# Altium project Power management module.PrjPcb
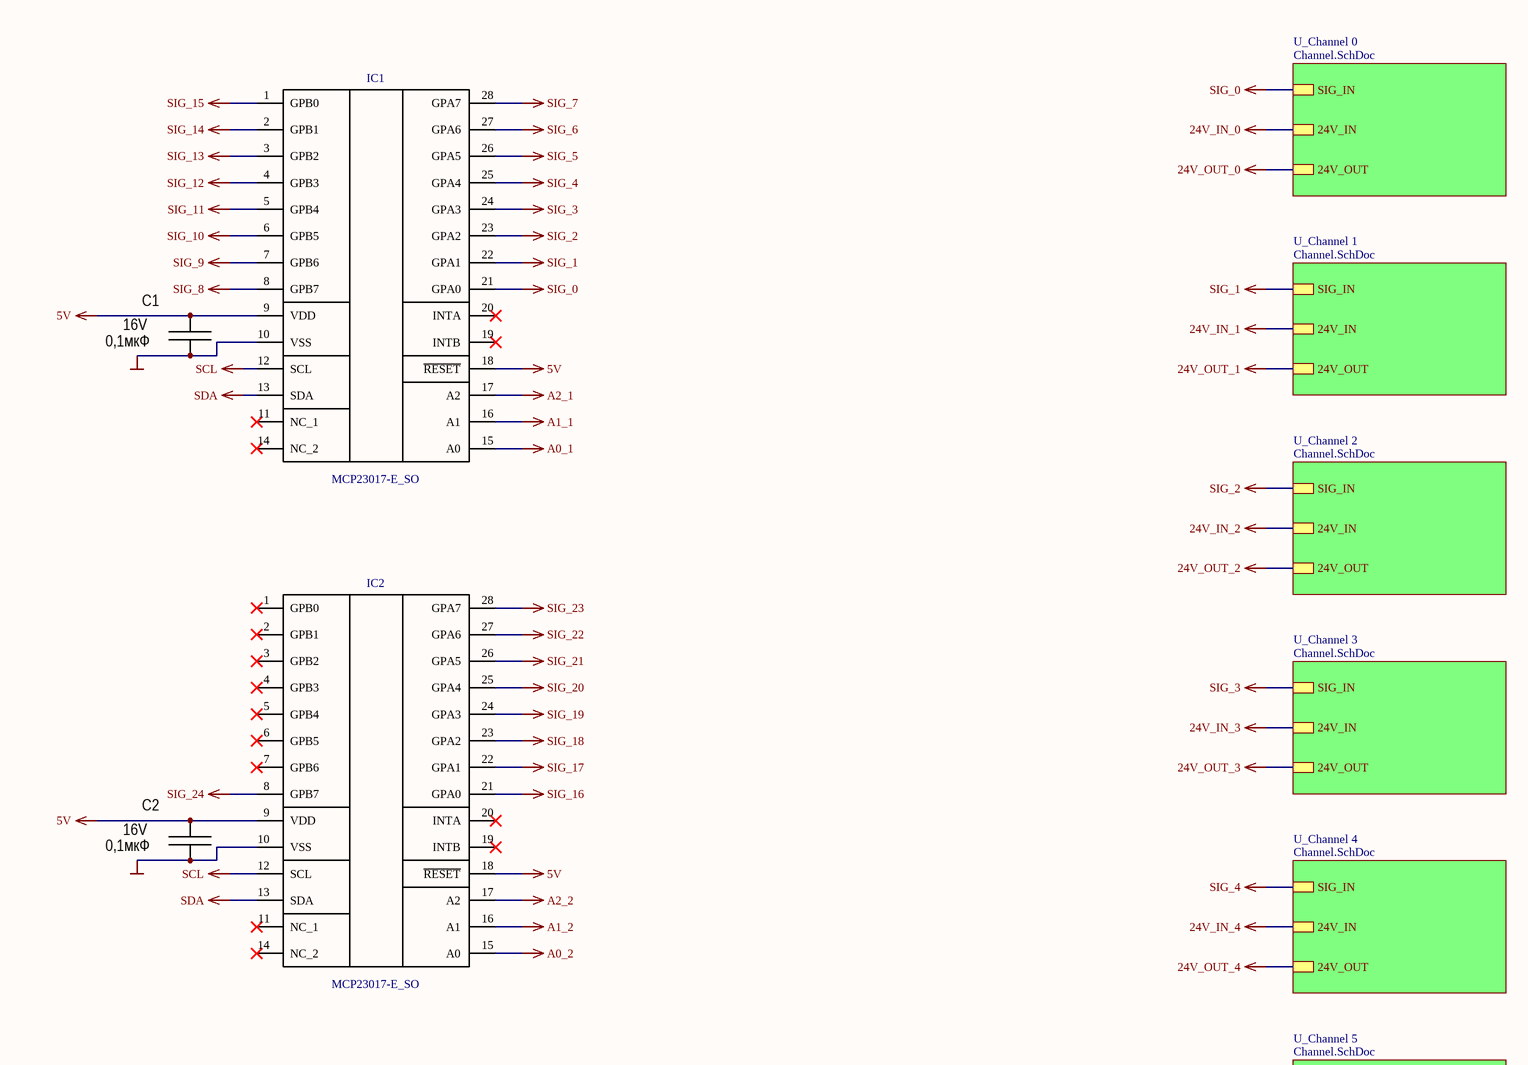
[diagram p0: Scheme.SchDoc, top left]
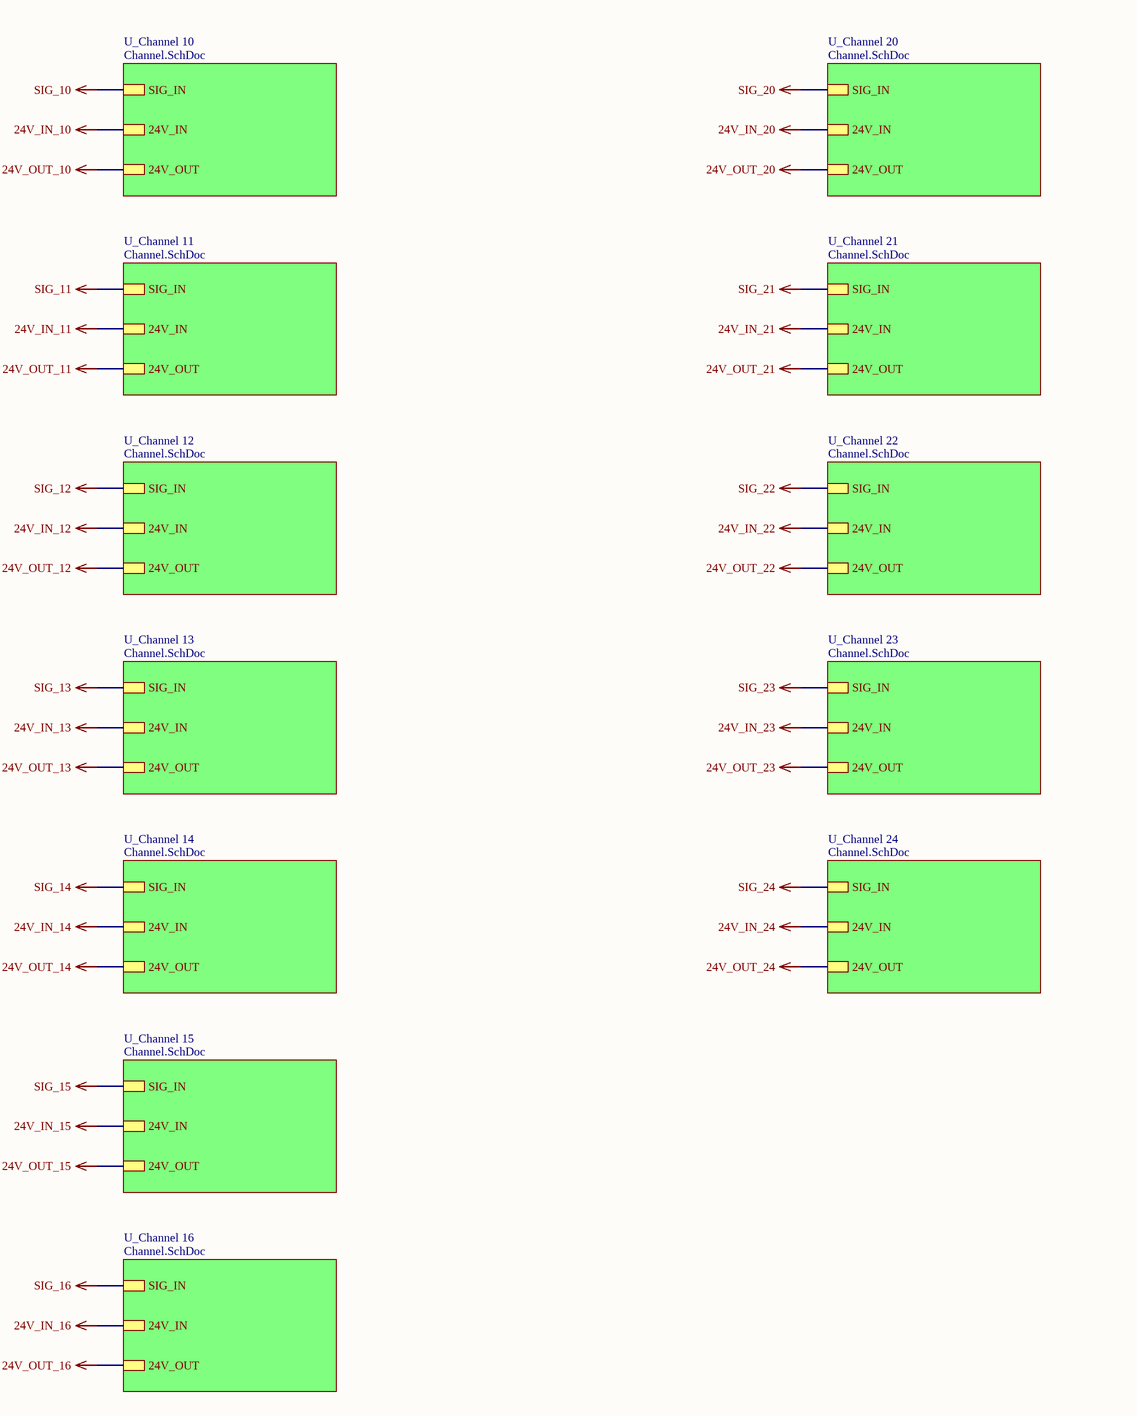
[diagram p1: Scheme.SchDoc, top right]
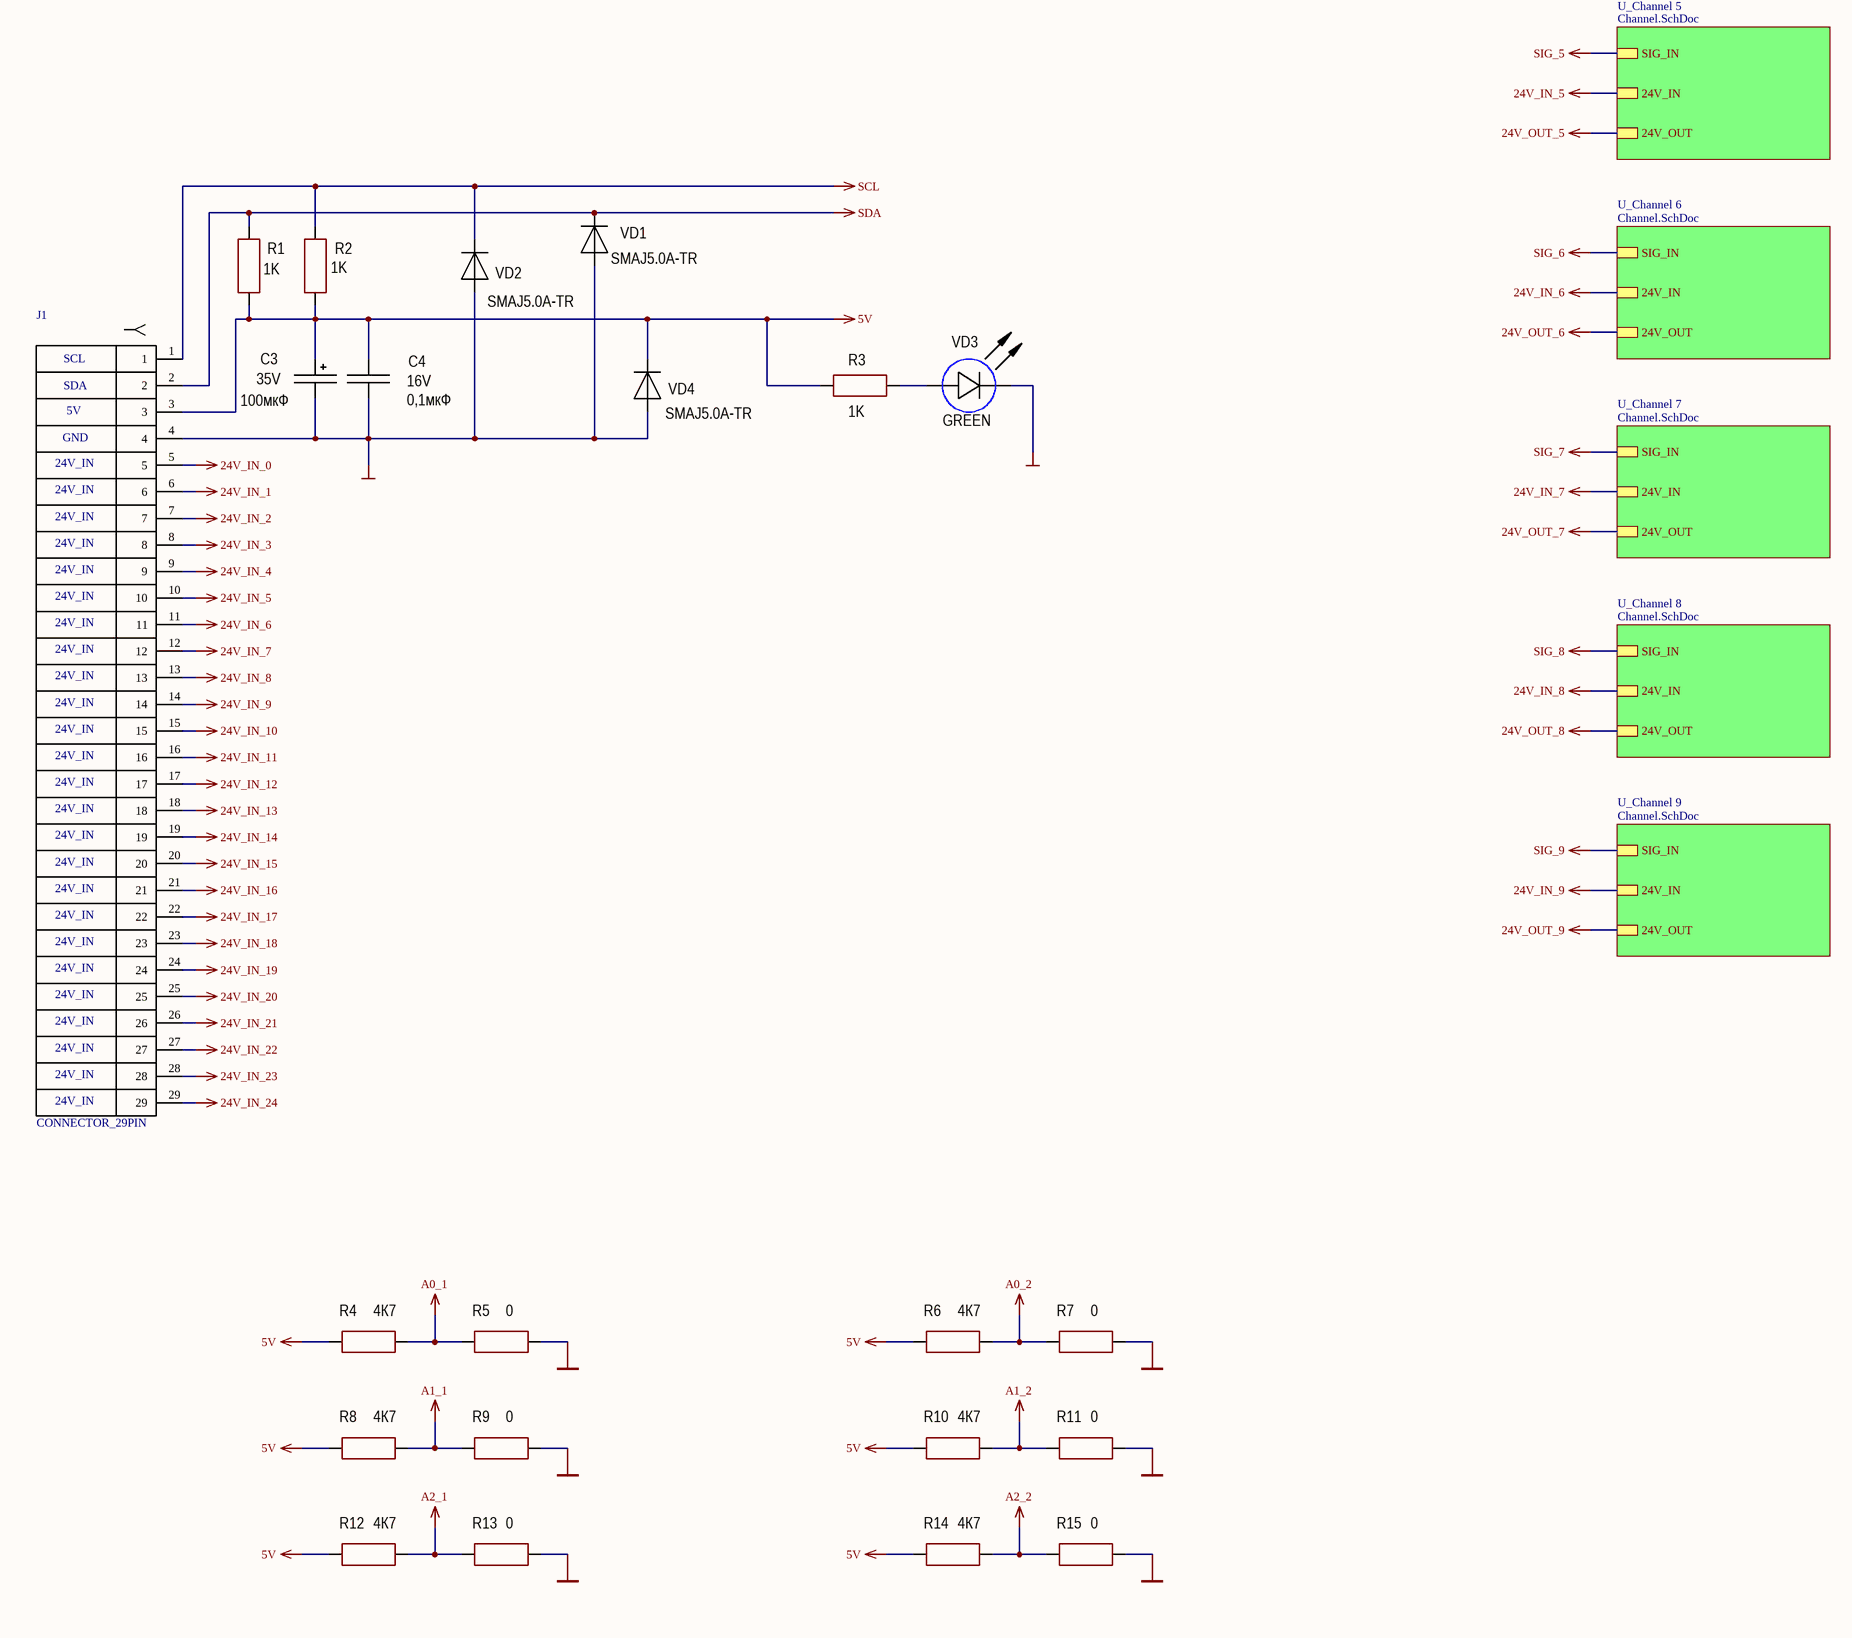
[diagram p2: Scheme.SchDoc, bottom left]
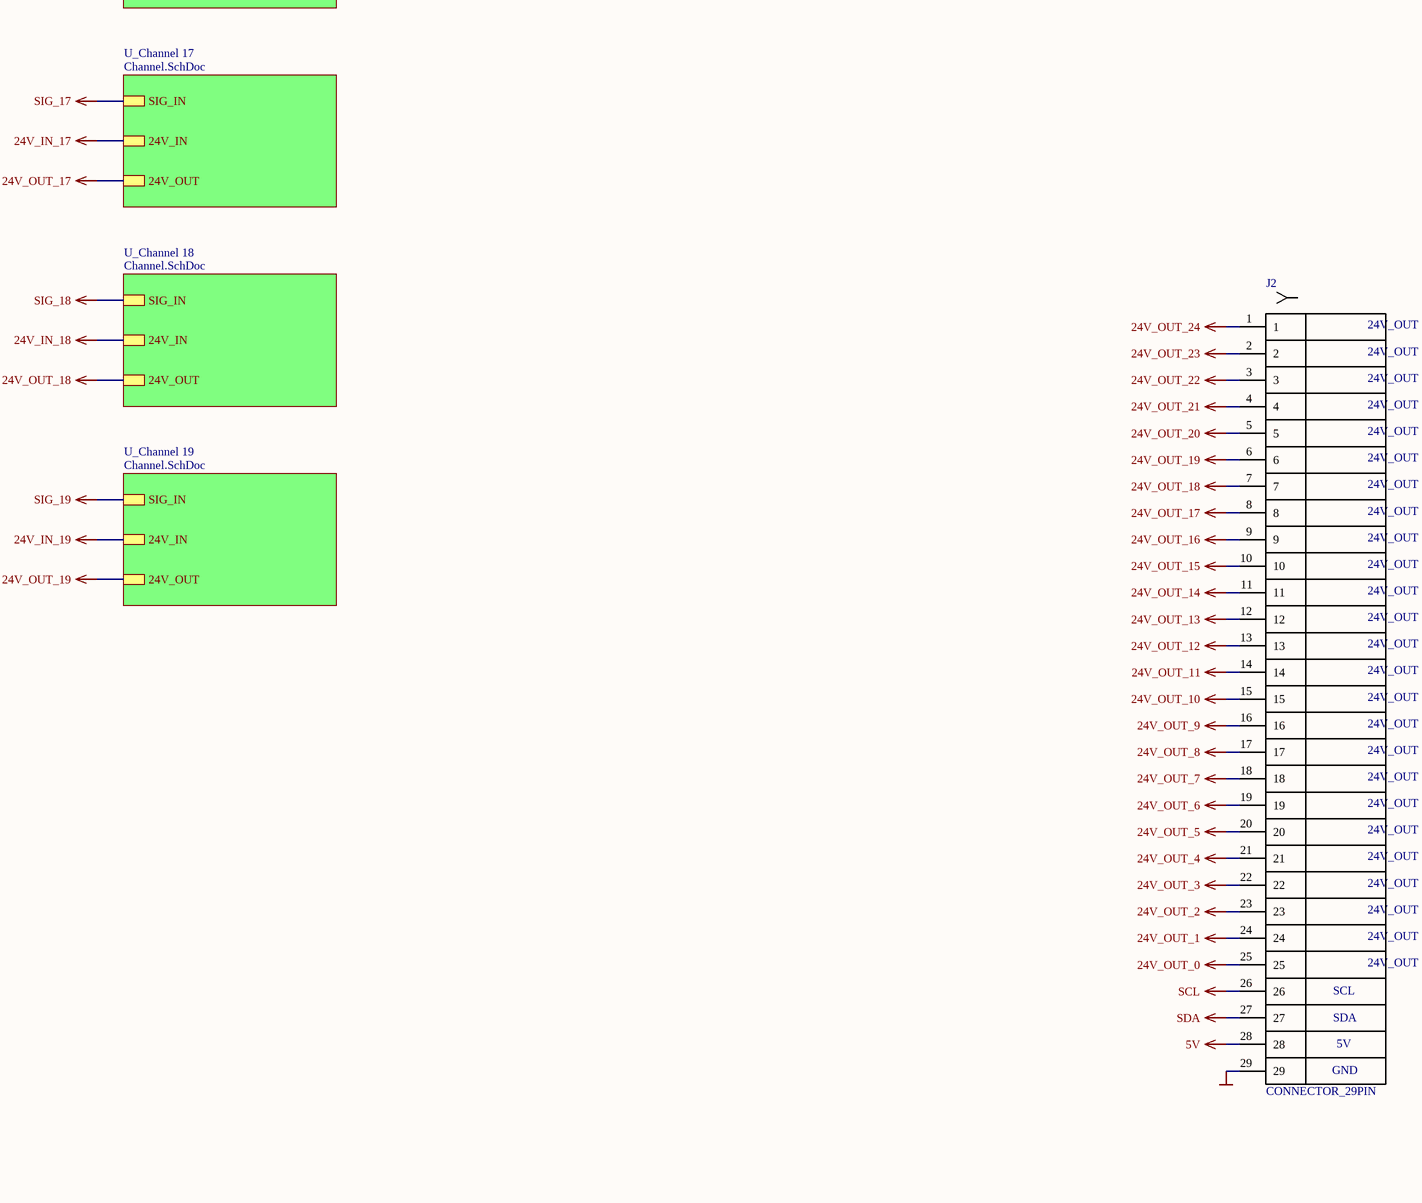
[diagram p3: Scheme.SchDoc, bottom right]
2 sheets, 227 parts. Net scope: hierarchical (ports join the sheet entries above them; power ports are global).
Board files: PCB.PcbDoc, PCB_v2.PcbDoc
Sheets:
  Scheme.SchDoc
    U_Channel 0 = Channel.SchDoc
    U_Channel 1 = Channel.SchDoc
    U_Channel 2 = Channel.SchDoc
    U_Channel 3 = Channel.SchDoc
    U_Channel 4 = Channel.SchDoc
    U_Channel 5 = Channel.SchDoc
    U_Channel 6 = Channel.SchDoc
    U_Channel 7 = Channel.SchDoc
    U_Channel 8 = Channel.SchDoc
    U_Channel 9 = Channel.SchDoc
    U_Channel 10 = Channel.SchDoc
    U_Channel 11 = Channel.SchDoc
    U_Channel 12 = Channel.SchDoc
    U_Channel 13 = Channel.SchDoc
    U_Channel 14 = Channel.SchDoc
    U_Channel 15 = Channel.SchDoc
    U_Channel 16 = Channel.SchDoc
    U_Channel 17 = Channel.SchDoc
    U_Channel 18 = Channel.SchDoc
    U_Channel 19 = Channel.SchDoc
    U_Channel 20 = Channel.SchDoc
    U_Channel 21 = Channel.SchDoc
    U_Channel 22 = Channel.SchDoc
    U_Channel 23 = Channel.SchDoc
    U_Channel 24 = Channel.SchDoc

## Sheet Scheme.SchDoc
size A1

### Parts
C1  value 0,1мкФ  Voltage: 16V  [CAP: 0805]
C2  value 0,1мкФ  Voltage: 16V  [CAP: 0805]
C3  value 100мкФ  Voltage: 35V  [CAP: D8C3.5H12]
C4  value 0,1мкФ  Voltage: 16V  [CAP: 0805]
IC1  MCP23017-E_SO  [SOIC127P1030X265-28N]
IC2  MCP23017-E_SO  [SOIC127P1030X265-28N]
J1  CONNECTOR_29PIN  [Connector_29pin]
J2  CONNECTOR_29PIN  [Connector_29pin]
R1  value 1K  [RES: 0805]
R2  value 1K  [RES: 0805]
R3  value 1K  [RES: 0805]
R4  value 4К7  [RES: 0805]
R5  value 0  [RES: 0805]
R6  value 4К7  [RES: 0805]
R7  value 0  [RES: 0805]
R8  value 4К7  [RES: 0805]
R9  value 0  [RES: 0805]
R10  value 4К7  [RES: 0805]
R11  value 0  [RES: 0805]
R12  value 4К7  [RES: 0805]
R13  value 0  [RES: 0805]
R14  value 4К7  [RES: 0805]
R15  value 0  [RES: 0805]
VD1  PartNumber: SMAJ5.0A-TR  [DIODE: SMA]
VD2  PartNumber: SMAJ5.0A-TR  [DIODE: SMA]
VD3  Color: GREEN  [1224HRC5]
VD4  PartNumber: SMAJ5.0A-TR  [DIODE: SMA]

### Sub-sheets
U_Channel 0 = Channel.SchDoc: SIG_IN, 24V_IN, 24V_OUT
U_Channel 1 = Channel.SchDoc: SIG_IN, 24V_IN, 24V_OUT
U_Channel 2 = Channel.SchDoc: SIG_IN, 24V_IN, 24V_OUT
U_Channel 3 = Channel.SchDoc: SIG_IN, 24V_IN, 24V_OUT
U_Channel 4 = Channel.SchDoc: SIG_IN, 24V_IN, 24V_OUT
U_Channel 5 = Channel.SchDoc: SIG_IN, 24V_IN, 24V_OUT
U_Channel 6 = Channel.SchDoc: SIG_IN, 24V_IN, 24V_OUT
U_Channel 7 = Channel.SchDoc: SIG_IN, 24V_IN, 24V_OUT
U_Channel 8 = Channel.SchDoc: SIG_IN, 24V_IN, 24V_OUT
U_Channel 9 = Channel.SchDoc: SIG_IN, 24V_IN, 24V_OUT
U_Channel 10 = Channel.SchDoc: SIG_IN, 24V_IN, 24V_OUT
U_Channel 11 = Channel.SchDoc: SIG_IN, 24V_IN, 24V_OUT
U_Channel 12 = Channel.SchDoc: SIG_IN, 24V_IN, 24V_OUT
U_Channel 13 = Channel.SchDoc: SIG_IN, 24V_IN, 24V_OUT
U_Channel 14 = Channel.SchDoc: SIG_IN, 24V_IN, 24V_OUT
U_Channel 15 = Channel.SchDoc: SIG_IN, 24V_IN, 24V_OUT
U_Channel 16 = Channel.SchDoc: SIG_IN, 24V_IN, 24V_OUT
U_Channel 17 = Channel.SchDoc: SIG_IN, 24V_IN, 24V_OUT
U_Channel 18 = Channel.SchDoc: SIG_IN, 24V_IN, 24V_OUT
U_Channel 19 = Channel.SchDoc: SIG_IN, 24V_IN, 24V_OUT
U_Channel 20 = Channel.SchDoc: SIG_IN, 24V_IN, 24V_OUT
U_Channel 21 = Channel.SchDoc: SIG_IN, 24V_IN, 24V_OUT
U_Channel 22 = Channel.SchDoc: SIG_IN, 24V_IN, 24V_OUT
U_Channel 23 = Channel.SchDoc: SIG_IN, 24V_IN, 24V_OUT
U_Channel 24 = Channel.SchDoc: SIG_IN, 24V_IN, 24V_OUT

### Nets
5V: C1.2 C2.2 C3.1 C4.2 IC1.9(VDD) IC1.18(~{RESET}) IC2.9(VDD) IC2.18(~{RESET}) J1.3 J2.28 R1.1 R2.1 R3.1 R4.1 R6.1 R8.1 R10.1 R12.1 R14.1 VD4.2
24V_IN_0: J1.5 ; sheet U_Channel 0/24V_IN
24V_IN_1: J1.6 ; sheet U_Channel 1/24V_IN
24V_IN_2: J1.7 ; sheet U_Channel 2/24V_IN
24V_IN_3: J1.8 ; sheet U_Channel 3/24V_IN
24V_IN_4: J1.9 ; sheet U_Channel 4/24V_IN
24V_IN_5: J1.10 ; sheet U_Channel 5/24V_IN
24V_IN_6: J1.11 ; sheet U_Channel 6/24V_IN
24V_IN_7: J1.12 ; sheet U_Channel 7/24V_IN
24V_IN_8: J1.13 ; sheet U_Channel 8/24V_IN
24V_IN_9: J1.14 ; sheet U_Channel 9/24V_IN
24V_IN_10: J1.15 ; sheet U_Channel 10/24V_IN
24V_IN_11: J1.16 ; sheet U_Channel 11/24V_IN
24V_IN_12: J1.17 ; sheet U_Channel 12/24V_IN
24V_IN_13: J1.18 ; sheet U_Channel 13/24V_IN
24V_IN_14: J1.19 ; sheet U_Channel 14/24V_IN
24V_IN_15: J1.20 ; sheet U_Channel 15/24V_IN
24V_IN_16: J1.21 ; sheet U_Channel 16/24V_IN
24V_IN_17: J1.22 ; sheet U_Channel 17/24V_IN
24V_IN_18: J1.23 ; sheet U_Channel 18/24V_IN
24V_IN_19: J1.24 ; sheet U_Channel 19/24V_IN
24V_IN_20: J1.25 ; sheet U_Channel 20/24V_IN
24V_IN_21: J1.26 ; sheet U_Channel 21/24V_IN
24V_IN_22: J1.27 ; sheet U_Channel 22/24V_IN
24V_IN_23: J1.28 ; sheet U_Channel 23/24V_IN
24V_IN_24: J1.29 ; sheet U_Channel 24/24V_IN
24V_OUT_0: J2.25 ; sheet U_Channel 0/24V_OUT
24V_OUT_1: J2.24 ; sheet U_Channel 1/24V_OUT
24V_OUT_2: J2.23 ; sheet U_Channel 2/24V_OUT
24V_OUT_3: J2.22 ; sheet U_Channel 3/24V_OUT
24V_OUT_4: J2.21 ; sheet U_Channel 4/24V_OUT
24V_OUT_5: J2.20 ; sheet U_Channel 5/24V_OUT
24V_OUT_6: J2.19 ; sheet U_Channel 6/24V_OUT
24V_OUT_7: J2.18 ; sheet U_Channel 7/24V_OUT
24V_OUT_8: J2.17 ; sheet U_Channel 8/24V_OUT
24V_OUT_9: J2.16 ; sheet U_Channel 9/24V_OUT
24V_OUT_10: J2.15 ; sheet U_Channel 10/24V_OUT
24V_OUT_11: J2.14 ; sheet U_Channel 11/24V_OUT
24V_OUT_12: J2.13 ; sheet U_Channel 12/24V_OUT
24V_OUT_13: J2.12 ; sheet U_Channel 13/24V_OUT
24V_OUT_14: J2.11 ; sheet U_Channel 14/24V_OUT
24V_OUT_15: J2.10 ; sheet U_Channel 15/24V_OUT
24V_OUT_16: J2.9 ; sheet U_Channel 16/24V_OUT
24V_OUT_17: J2.8 ; sheet U_Channel 17/24V_OUT
24V_OUT_18: J2.7 ; sheet U_Channel 18/24V_OUT
24V_OUT_19: J2.6 ; sheet U_Channel 19/24V_OUT
24V_OUT_20: J2.5 ; sheet U_Channel 20/24V_OUT
24V_OUT_21: J2.4 ; sheet U_Channel 21/24V_OUT
24V_OUT_22: J2.3 ; sheet U_Channel 22/24V_OUT
24V_OUT_23: J2.2 ; sheet U_Channel 23/24V_OUT
24V_OUT_24: J2.1 ; sheet U_Channel 24/24V_OUT
A0_1: IC1.15(A0) R4.2 R5.1
A0_2: IC2.15(A0) R6.2 R7.1
A1_1: IC1.16(A1) R8.2 R9.1
A1_2: IC2.16(A1) R10.2 R11.1
A2_1: IC1.17(A2) R12.2 R13.1
A2_2: IC2.17(A2) R14.2 R15.1
GND: C1.1 C2.1 C3.2 C4.1 IC1.10(VSS) IC2.10(VSS) J1.4 J2.29 R5.2 R7.2 R9.2 R11.2 R13.2 R15.2 VD1.1 VD2.1 VD3.2(C) VD4.1
SCL: IC1.12(SCL) IC2.12(SCL) J1.1 J2.26 R2.2 VD2.2
SDA: IC1.13(SDA) IC2.13(SDA) J1.2 J2.27 R1.2 VD1.2
SIG_0: IC1.21(GPA0) ; sheet U_Channel 0/SIG_IN
SIG_1: IC1.22(GPA1) ; sheet U_Channel 1/SIG_IN
SIG_2: IC1.23(GPA2) ; sheet U_Channel 2/SIG_IN
SIG_3: IC1.24(GPA3) ; sheet U_Channel 3/SIG_IN
SIG_4: IC1.25(GPA4) ; sheet U_Channel 4/SIG_IN
SIG_5: IC1.26(GPA5) ; sheet U_Channel 5/SIG_IN
SIG_6: IC1.27(GPA6) ; sheet U_Channel 6/SIG_IN
SIG_7: IC1.28(GPA7) ; sheet U_Channel 7/SIG_IN
SIG_8: IC1.8(GPB7) ; sheet U_Channel 8/SIG_IN
SIG_9: IC1.7(GPB6) ; sheet U_Channel 9/SIG_IN
SIG_10: IC1.6(GPB5) ; sheet U_Channel 10/SIG_IN
SIG_11: IC1.5(GPB4) ; sheet U_Channel 11/SIG_IN
SIG_12: IC1.4(GPB3) ; sheet U_Channel 12/SIG_IN
SIG_13: IC1.3(GPB2) ; sheet U_Channel 13/SIG_IN
SIG_14: IC1.2(GPB1) ; sheet U_Channel 14/SIG_IN
SIG_15: IC1.1(GPB0) ; sheet U_Channel 15/SIG_IN
SIG_16: IC2.21(GPA0) ; sheet U_Channel 16/SIG_IN
SIG_17: IC2.22(GPA1) ; sheet U_Channel 17/SIG_IN
SIG_18: IC2.23(GPA2) ; sheet U_Channel 18/SIG_IN
SIG_19: IC2.24(GPA3) ; sheet U_Channel 19/SIG_IN
SIG_20: IC2.25(GPA4) ; sheet U_Channel 20/SIG_IN
SIG_21: IC2.26(GPA5) ; sheet U_Channel 21/SIG_IN
SIG_22: IC2.27(GPA6) ; sheet U_Channel 22/SIG_IN
SIG_23: IC2.28(GPA7) ; sheet U_Channel 23/SIG_IN
SIG_24: IC2.8(GPB7) ; sheet U_Channel 24/SIG_IN
NetR3_2: R3.2 VD3.1(A)

Not connected (* = marked no-connect by the designer): IC1 11(NC_1)* 14(NC_2)* 19(INTB)* 20(INTA)*; IC2 1(GPB0)* 2(GPB1)* 3(GPB2)* 4(GPB3)* 5(GPB4)* 6(GPB5)* 7(GPB6)* 11(NC_1)* 14(NC_2)* 19(INTB)* 20(INTA)*

### Notes on the sheet
- SDA
- SCL
- GND
- 5V
- 24V_IN
- 24V_OUT

### Library data of the parts
C1 C2 C4 = Ceramic_0805: Manufacturer: Yageo; PartNumber: CC0805KRX7R7BB104; ValueManufacturerPartNumber: Ceramic capacitor, 0,1мкФ, X7R, ±10%, 16V, 0805, -55...+125°C; TypeCapacitor: Ceramic capacitor; Tolerance: ±10%; TypeDielectric: X7R; Package: 0805; HelpURL: https://www.digikey.com/product-detail/en/yageo/CC0805KRX7R7BB104/311-1142-1-ND/303052; Temperature: -55...+125°C
C3 = Aluminium: Manufacturer: Wurth; PartNumber: 860080475013; ValueManufacturerPartNumber: Aluminium capacitor, 100мкФ, 35V, ±20%, 54mOhm, 14x10x5 mm, -55...+105°C; TypeCapacitor: Aluminium capacitor; Tolerance: ±20%; Impedance: 54mOhm; Package: 14x10x5 mm; HelpURL: https://www.digikey.com/product-detail/en/wurth-electronics-inc/860080475013/732-9029-1-ND/5728972; Temperature: -55...+105°C
IC1 IC2 = MCP23017-E_SO: Integrated Circuit; Manufacturer_Name: Microchip; Manufacturer_Part_Number: MCP23017-E/SO; Datasheet Link: http://docs-emea.rs-online.com/webdocs/0a78/0900766b80a784c3.pdf; Height: 2.65mm; Mouser Part Number: 579-MCP23017-E/SO; Mouser Price/Stock: https://www.mouser.co.uk/ProductDetail/Microchip-Technology/MCP23017-E-SO?qs=usxtMOJb1Rz8hft7vV7YMQ%3D%3D; Arrow Part Number: MCP23017-E/SO; Arrow Price/Stock: https://www.arrow.com/en/products/mcp23017-eso/microchip-technology
J1 J2 = CONNECTOR_29PIN: Connector 29 pin
R1-R3 = Resistor_0805: Manufacturer: Yageo; PartNumber: RC0805JR-07100RL; ValueManufacturerPartNumber: Resistor film, 1K, ±5%, 0805, 0.125W, -55...+125°C; TypeResistor: Resistor film; Power: 0.125W; Tolerance: ±5%; Package: 0805; HelpURL: https://www.digikey.com/product-detail/en/yageo/RC0805JR-07100RL/311-100ARCT-ND/731185; Temperature: -55...+125°C
R4 R6 R8 R10 R12 R14 = Resistor_0805: Manufacturer: Yageo; PartNumber: RC0805JR-07100RL; ValueManufacturerPartNumber: Resistor film, 4К7, ±5%, 0805, 0.125W, -55...+125°C; TypeResistor: Resistor film; Power: 0.125W; Tolerance: ±5%; Package: 0805; HelpURL: https://www.digikey.com/product-detail/en/yageo/RC0805JR-07100RL/311-100ARCT-ND/731185; Temperature: -55...+125°C
R5 R7 R9 R11 R13 R15 = Resistor_0805: Manufacturer: Yageo; PartNumber: RC0805JR-07100RL; ValueManufacturerPartNumber: Resistor film, 0, ±5%, 0805, 0.125W, -55...+125°C; TypeResistor: Resistor film; Power: 0.125W; Tolerance: ±5%; Package: 0805; HelpURL: https://www.digikey.com/product-detail/en/yageo/RC0805JR-07100RL/311-100ARCT-ND/731185; Temperature: -55...+125°C
VD1 VD2 VD4 = Diode_single: Manufacturer: Micro Commercial; ValueManufacturerPartNumber: Single diode, 75V, 150mA, 1V, 4ns, SOD-323, -55...+150°C; TypeDiode: Single diode; Voltage: 75V; Current: 150mA; VoltageDrop: 1V; RecoveryTime: 4ns; Package: SOD-323; HelpURL: https://www.digikey.com/product-detail/en/micro-commercial-co/1N4148WX-TP/1N4148WXTPMSCT-ND/717312; Temperature: -55...+150°C
VD3 = LED_single: ValueManufacturerPartNumber: LED, Green, *, *, *, -55...+150°C; TypeDiode: LED; Manufacturer: *; Package: *; HelpURL: *; Temperature: -55...+150°C; Current: *; VoltageDrop: *; PartNumber: *; ColorParameter: Green

## Sheet Channel.SchDoc
size A4
Used 25 times, as channels U_Channel 0, U_Channel 1, U_Channel 2, U_Channel 3, U_Channel 4, U_Channel 5, U_Channel 6, U_Channel 7, U_Channel 8, U_Channel 9, U_Channel 10, U_Channel 11, U_Channel 12, U_Channel 13, U_Channel 14, U_Channel 15, U_Channel 16, U_Channel 17, U_Channel 18, U_Channel 19, U_Channel 20, U_Channel 21, U_Channel 22, U_Channel 23, U_Channel 24. Parts and nets are listed once, with the designators drawn on the sheet.
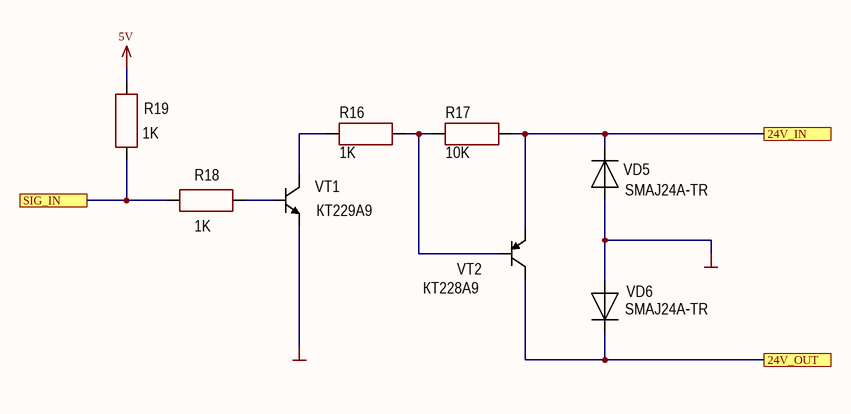
[diagram p4: Channel.SchDoc]

### Parts
R16  value 1K  [RES: 1206]
R17  value 10K  [RES: 1206]
R18  value 1K  [RES: 0805]
R19  value 1K  [RES: 0805]
VD5  PartNumber: SMAJ24A-TR  [DIODE: SMA]
VD6  PartNumber: SMAJ24A-TR  [DIODE: SMA]
VT1  PartNumber: КТ229А9  [SOT23]
VT2  PartNumber: КТ228А9  [SOT23]

### Ports
24V_IN, 24V_OUT, SIG_IN

### Nets
5V: R19.2
GND: VD5.1 VD6.1 VT1.2(E)
24V_IN: R17.1 VD5.2 VT2.2(E) ; port 24V_IN
24V_OUT: VD6.2 VT2.3(C) ; port 24V_OUT
SIG_IN: R18.1 R19.1 ; port SIG_IN
NetR16_1: R16.1 R17.2 VT2.1(B)
NetR16_2: R16.2 VT1.3(C)
NetR18_2: R18.2 VT1.1(B)

### Channels
U_Channel 0: designators end in _1; ports 24V_IN=24V_IN_0 24V_OUT=24V_OUT_0 SIG_IN=SIG_0
U_Channel 1: designators end in _2; ports 24V_IN=24V_IN_1 24V_OUT=24V_OUT_1 SIG_IN=SIG_1
U_Channel 2: designators end in _3; ports 24V_IN=24V_IN_2 24V_OUT=24V_OUT_2 SIG_IN=SIG_2
U_Channel 3: designators end in _4; ports 24V_IN=24V_IN_3 24V_OUT=24V_OUT_3 SIG_IN=SIG_3
U_Channel 4: designators end in _5; ports 24V_IN=24V_IN_4 24V_OUT=24V_OUT_4 SIG_IN=SIG_4
U_Channel 5: designators end in _6; ports 24V_IN=24V_IN_5 24V_OUT=24V_OUT_5 SIG_IN=SIG_5
U_Channel 6: designators end in _7; ports 24V_IN=24V_IN_6 24V_OUT=24V_OUT_6 SIG_IN=SIG_6
U_Channel 7: designators end in _8; ports 24V_IN=24V_IN_7 24V_OUT=24V_OUT_7 SIG_IN=SIG_7
U_Channel 8: designators end in _9; ports 24V_IN=24V_IN_8 24V_OUT=24V_OUT_8 SIG_IN=SIG_8
U_Channel 9: designators end in _10; ports 24V_IN=24V_IN_9 24V_OUT=24V_OUT_9 SIG_IN=SIG_9
U_Channel 10: designators end in _11; ports 24V_IN=24V_IN_10 24V_OUT=24V_OUT_10 SIG_IN=SIG_10
U_Channel 11: designators end in _12; ports 24V_IN=24V_IN_11 24V_OUT=24V_OUT_11 SIG_IN=SIG_11
U_Channel 12: designators end in _13; ports 24V_IN=24V_IN_12 24V_OUT=24V_OUT_12 SIG_IN=SIG_12
U_Channel 13: designators end in _14; ports 24V_IN=24V_IN_13 24V_OUT=24V_OUT_13 SIG_IN=SIG_13
U_Channel 14: designators end in _15; ports 24V_IN=24V_IN_14 24V_OUT=24V_OUT_14 SIG_IN=SIG_14
U_Channel 15: designators end in _16; ports 24V_IN=24V_IN_15 24V_OUT=24V_OUT_15 SIG_IN=SIG_15
U_Channel 16: designators end in _17; ports 24V_IN=24V_IN_16 24V_OUT=24V_OUT_16 SIG_IN=SIG_16
U_Channel 17: designators end in _18; ports 24V_IN=24V_IN_17 24V_OUT=24V_OUT_17 SIG_IN=SIG_17
U_Channel 18: designators end in _19; ports 24V_IN=24V_IN_18 24V_OUT=24V_OUT_18 SIG_IN=SIG_18
U_Channel 19: designators end in _20; ports 24V_IN=24V_IN_19 24V_OUT=24V_OUT_19 SIG_IN=SIG_19
U_Channel 20: designators end in _21; ports 24V_IN=24V_IN_20 24V_OUT=24V_OUT_20 SIG_IN=SIG_20
U_Channel 21: designators end in _22; ports 24V_IN=24V_IN_21 24V_OUT=24V_OUT_21 SIG_IN=SIG_21
U_Channel 22: designators end in _23; ports 24V_IN=24V_IN_22 24V_OUT=24V_OUT_22 SIG_IN=SIG_22
U_Channel 23: designators end in _24; ports 24V_IN=24V_IN_23 24V_OUT=24V_OUT_23 SIG_IN=SIG_23
U_Channel 24: designators end in _25; ports 24V_IN=24V_IN_24 24V_OUT=24V_OUT_24 SIG_IN=SIG_24

### Library data of the parts
R16 = Resistor_1206: Manufacturer: Yageo; PartNumber: RC1206JR-07100RL; ValueManufacturerPartNumber: Resistor film, 1K, ±5%, 1206, 0.25W, -55...+125°C; TypeResistor: Resistor film; Power: 0.25W; Tolerance: ±5%; Package: 1206; HelpURL: https://www.digikey.com/product-detail/en/yageo/RC1206JR-07100RL/311-100ERCT-ND/732153; Temperature: -55...+125°C
R17 = Resistor_1206: Manufacturer: Yageo; PartNumber: RC1206JR-07100RL; ValueManufacturerPartNumber: Resistor film, 10K, ±5%, 1206, 0.25W, -55...+125°C; TypeResistor: Resistor film; Power: 0.25W; Tolerance: ±5%; Package: 1206; HelpURL: https://www.digikey.com/product-detail/en/yageo/RC1206JR-07100RL/311-100ERCT-ND/732153; Temperature: -55...+125°C
R18 R19 = Resistor_0805: as R1 on sheet Scheme; Package: 0805; HelpURL: https://www.digikey.com/product-detail/en/yageo/RC0805JR-07100RL/311-100ARCT-ND/731185; Temperature: -55...+125°C
VD5 VD6 = Diode_single: as VD1 on sheet Scheme; Package: SOD-323; HelpURL: https://www.digikey.com/product-detail/en/micro-commercial-co/1N4148WX-TP/1N4148WXTPMSCT-ND/717312; Temperature: -55...+150°C
VT1 = BJT_NPN_132: Manufacturer: ON Semiconductor; ValueManufacturerPartNumber: NPN transistor, 45V, 100mA, 100MHz, 300mW, 0.6V, 420, SOT-23, -55...+125°C; TypeTransistor: NPN transistor; VoltageCE: 45V; CurrentCE: 100mA; VoltageSaturation: 0.6V; Frequency: 100MHz; CurrentGain: 420; MaxPower: 300mW; Package: SOT-23; HelpURL: https://www.digikey.com/product-detail/en/on-semiconductor/BC847CLT1G/BC847CLT1GOSCT-ND/917836; Temperature: -55...+125°C
VT2 = BJT_PNP_123: Manufacturer: ON Semiconductor; ValueManufacturerPartNumber: PNP transistor, 45V, 100mA, 100MHz, 300mW, 0.65V, 220, SOT-23, -55...+125°C; TypeTransistor: PNP transistor; VoltageCE: 45V; CurrentCE: 100mA; VoltageSaturation: 0.65V; Frequency: 100MHz; CurrentGain: 220; MaxPower: 300mW; Package: SOT-23; HelpURL: https://www.digikey.com/product-detail/en/on-semiconductor/BC857BLT3G/BC857BLT3GOSCT-ND/2704963; Temperature: -55...+125°C

## Nets that join several sheets
5V: Scheme (20 pins), U_Channel 0 (R19_1.2), U_Channel 1 (R19_2.2), U_Channel 2 (R19_3.2), U_Channel 3 (R19_4.2), U_Channel 4 (R19_5.2), U_Channel 5 (R19_6.2), U_Channel 6 (R19_7.2), U_Channel 7 (R19_8.2), U_Channel 8 (R19_9.2), U_Channel 9 (R19_10.2), U_Channel 10 (R19_11.2), U_Channel 11 (R19_12.2), U_Channel 12 (R19_13.2), U_Channel 13 (R19_14.2), U_Channel 14 (R19_15.2), U_Channel 15 (R19_16.2), U_Channel 16 (R19_17.2), U_Channel 17 (R19_18.2), U_Channel 18 (R19_19.2), U_Channel 19 (R19_20.2), U_Channel 20 (R19_21.2), U_Channel 21 (R19_22.2), U_Channel 22 (R19_23.2), U_Channel 23 (R19_24.2), U_Channel 24 (R19_25.2)
24V_IN_0: Scheme (J1.5), U_Channel 0 (R17_1.1 VD5_1.2 VT2_1.2)
24V_IN_1: Scheme (J1.6), U_Channel 1 (R17_2.1 VD5_2.2 VT2_2.2)
24V_IN_2: Scheme (J1.7), U_Channel 2 (R17_3.1 VD5_3.2 VT2_3.2)
24V_IN_3: Scheme (J1.8), U_Channel 3 (R17_4.1 VD5_4.2 VT2_4.2)
24V_IN_4: Scheme (J1.9), U_Channel 4 (R17_5.1 VD5_5.2 VT2_5.2)
24V_IN_5: Scheme (J1.10), U_Channel 5 (R17_6.1 VD5_6.2 VT2_6.2)
24V_IN_6: Scheme (J1.11), U_Channel 6 (R17_7.1 VD5_7.2 VT2_7.2)
24V_IN_7: Scheme (J1.12), U_Channel 7 (R17_8.1 VD5_8.2 VT2_8.2)
24V_IN_8: Scheme (J1.13), U_Channel 8 (R17_9.1 VD5_9.2 VT2_9.2)
24V_IN_9: Scheme (J1.14), U_Channel 9 (R17_10.1 VD5_10.2 VT2_10.2)
24V_IN_10: Scheme (J1.15), U_Channel 10 (R17_11.1 VD5_11.2 VT2_11.2)
24V_IN_11: Scheme (J1.16), U_Channel 11 (R17_12.1 VD5_12.2 VT2_12.2)
24V_IN_12: Scheme (J1.17), U_Channel 12 (R17_13.1 VD5_13.2 VT2_13.2)
24V_IN_13: Scheme (J1.18), U_Channel 13 (R17_14.1 VD5_14.2 VT2_14.2)
24V_IN_14: Scheme (J1.19), U_Channel 14 (R17_15.1 VD5_15.2 VT2_15.2)
24V_IN_15: Scheme (J1.20), U_Channel 15 (R17_16.1 VD5_16.2 VT2_16.2)
24V_IN_16: Scheme (J1.21), U_Channel 16 (R17_17.1 VD5_17.2 VT2_17.2)
24V_IN_17: Scheme (J1.22), U_Channel 17 (R17_18.1 VD5_18.2 VT2_18.2)
24V_IN_18: Scheme (J1.23), U_Channel 18 (R17_19.1 VD5_19.2 VT2_19.2)
24V_IN_19: Scheme (J1.24), U_Channel 19 (R17_20.1 VD5_20.2 VT2_20.2)
24V_IN_20: Scheme (J1.25), U_Channel 20 (R17_21.1 VD5_21.2 VT2_21.2)
24V_IN_21: Scheme (J1.26), U_Channel 21 (R17_22.1 VD5_22.2 VT2_22.2)
24V_IN_22: Scheme (J1.27), U_Channel 22 (R17_23.1 VD5_23.2 VT2_23.2)
24V_IN_23: Scheme (J1.28), U_Channel 23 (R17_24.1 VD5_24.2 VT2_24.2)
24V_IN_24: Scheme (J1.29), U_Channel 24 (R17_25.1 VD5_25.2 VT2_25.2)
24V_OUT_0: Scheme (J2.25), U_Channel 0 (VD6_1.2 VT2_1.3)
24V_OUT_1: Scheme (J2.24), U_Channel 1 (VD6_2.2 VT2_2.3)
24V_OUT_2: Scheme (J2.23), U_Channel 2 (VD6_3.2 VT2_3.3)
24V_OUT_3: Scheme (J2.22), U_Channel 3 (VD6_4.2 VT2_4.3)
24V_OUT_4: Scheme (J2.21), U_Channel 4 (VD6_5.2 VT2_5.3)
24V_OUT_5: Scheme (J2.20), U_Channel 5 (VD6_6.2 VT2_6.3)
24V_OUT_6: Scheme (J2.19), U_Channel 6 (VD6_7.2 VT2_7.3)
24V_OUT_7: Scheme (J2.18), U_Channel 7 (VD6_8.2 VT2_8.3)
24V_OUT_8: Scheme (J2.17), U_Channel 8 (VD6_9.2 VT2_9.3)
24V_OUT_9: Scheme (J2.16), U_Channel 9 (VD6_10.2 VT2_10.3)
24V_OUT_10: Scheme (J2.15), U_Channel 10 (VD6_11.2 VT2_11.3)
24V_OUT_11: Scheme (J2.14), U_Channel 11 (VD6_12.2 VT2_12.3)
24V_OUT_12: Scheme (J2.13), U_Channel 12 (VD6_13.2 VT2_13.3)
24V_OUT_13: Scheme (J2.12), U_Channel 13 (VD6_14.2 VT2_14.3)
24V_OUT_14: Scheme (J2.11), U_Channel 14 (VD6_15.2 VT2_15.3)
24V_OUT_15: Scheme (J2.10), U_Channel 15 (VD6_16.2 VT2_16.3)
24V_OUT_16: Scheme (J2.9), U_Channel 16 (VD6_17.2 VT2_17.3)
24V_OUT_17: Scheme (J2.8), U_Channel 17 (VD6_18.2 VT2_18.3)
24V_OUT_18: Scheme (J2.7), U_Channel 18 (VD6_19.2 VT2_19.3)
24V_OUT_19: Scheme (J2.6), U_Channel 19 (VD6_20.2 VT2_20.3)
24V_OUT_20: Scheme (J2.5), U_Channel 20 (VD6_21.2 VT2_21.3)
24V_OUT_21: Scheme (J2.4), U_Channel 21 (VD6_22.2 VT2_22.3)
24V_OUT_22: Scheme (J2.3), U_Channel 22 (VD6_23.2 VT2_23.3)
24V_OUT_23: Scheme (J2.2), U_Channel 23 (VD6_24.2 VT2_24.3)
24V_OUT_24: Scheme (J2.1), U_Channel 24 (VD6_25.2 VT2_25.3)
GND: Scheme (18 pins), U_Channel 0 (VD5_1.1 VD6_1.1 VT1_1.2), U_Channel 1 (VD5_2.1 VD6_2.1 VT1_2.2), U_Channel 2 (VD5_3.1 VD6_3.1 VT1_3.2), U_Channel 3 (VD5_4.1 VD6_4.1 VT1_4.2), U_Channel 4 (VD5_5.1 VD6_5.1 VT1_5.2), U_Channel 5 (VD5_6.1 VD6_6.1 VT1_6.2), U_Channel 6 (VD5_7.1 VD6_7.1 VT1_7.2), U_Channel 7 (VD5_8.1 VD6_8.1 VT1_8.2), U_Channel 8 (VD5_9.1 VD6_9.1 VT1_9.2), U_Channel 9 (VD5_10.1 VD6_10.1 VT1_10.2), U_Channel 10 (VD5_11.1 VD6_11.1 VT1_11.2), U_Channel 11 (VD5_12.1 VD6_12.1 VT1_12.2), U_Channel 12 (VD5_13.1 VD6_13.1 VT1_13.2), U_Channel 13 (VD5_14.1 VD6_14.1 VT1_14.2), U_Channel 14 (VD5_15.1 VD6_15.1 VT1_15.2), U_Channel 15 (VD5_16.1 VD6_16.1 VT1_16.2), U_Channel 16 (VD5_17.1 VD6_17.1 VT1_17.2), U_Channel 17 (VD5_18.1 VD6_18.1 VT1_18.2), U_Channel 18 (VD5_19.1 VD6_19.1 VT1_19.2), U_Channel 19 (VD5_20.1 VD6_20.1 VT1_20.2), U_Channel 20 (VD5_21.1 VD6_21.1 VT1_21.2), U_Channel 21 (VD5_22.1 VD6_22.1 VT1_22.2), U_Channel 22 (VD5_23.1 VD6_23.1 VT1_23.2), U_Channel 23 (VD5_24.1 VD6_24.1 VT1_24.2), U_Channel 24 (VD5_25.1 VD6_25.1 VT1_25.2)
SIG_0: Scheme (IC1.21), U_Channel 0 (R18_1.1 R19_1.1)
SIG_1: Scheme (IC1.22), U_Channel 1 (R18_2.1 R19_2.1)
SIG_2: Scheme (IC1.23), U_Channel 2 (R18_3.1 R19_3.1)
SIG_3: Scheme (IC1.24), U_Channel 3 (R18_4.1 R19_4.1)
SIG_4: Scheme (IC1.25), U_Channel 4 (R18_5.1 R19_5.1)
SIG_5: Scheme (IC1.26), U_Channel 5 (R18_6.1 R19_6.1)
SIG_6: Scheme (IC1.27), U_Channel 6 (R18_7.1 R19_7.1)
SIG_7: Scheme (IC1.28), U_Channel 7 (R18_8.1 R19_8.1)
SIG_8: Scheme (IC1.8), U_Channel 8 (R18_9.1 R19_9.1)
SIG_9: Scheme (IC1.7), U_Channel 9 (R18_10.1 R19_10.1)
SIG_10: Scheme (IC1.6), U_Channel 10 (R18_11.1 R19_11.1)
SIG_11: Scheme (IC1.5), U_Channel 11 (R18_12.1 R19_12.1)
SIG_12: Scheme (IC1.4), U_Channel 12 (R18_13.1 R19_13.1)
SIG_13: Scheme (IC1.3), U_Channel 13 (R18_14.1 R19_14.1)
SIG_14: Scheme (IC1.2), U_Channel 14 (R18_15.1 R19_15.1)
SIG_15: Scheme (IC1.1), U_Channel 15 (R18_16.1 R19_16.1)
SIG_16: Scheme (IC2.21), U_Channel 16 (R18_17.1 R19_17.1)
SIG_17: Scheme (IC2.22), U_Channel 17 (R18_18.1 R19_18.1)
SIG_18: Scheme (IC2.23), U_Channel 18 (R18_19.1 R19_19.1)
SIG_19: Scheme (IC2.24), U_Channel 19 (R18_20.1 R19_20.1)
SIG_20: Scheme (IC2.25), U_Channel 20 (R18_21.1 R19_21.1)
SIG_21: Scheme (IC2.26), U_Channel 21 (R18_22.1 R19_22.1)
SIG_22: Scheme (IC2.27), U_Channel 22 (R18_23.1 R19_23.1)
SIG_23: Scheme (IC2.28), U_Channel 23 (R18_24.1 R19_24.1)
SIG_24: Scheme (IC2.8), U_Channel 24 (R18_25.1 R19_25.1)